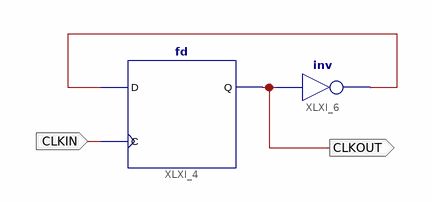
[diagram p0: schematic sheet 1]
// Xilinx ISE schematic ClockDiv2.sch (xbr) as structural Verilog: 2 symbols, 2 ports
module ClockDiv2 (
  input  CLKIN,
  output CLKOUT
);

  wire XLXN_1;

  fd XLXI_4 (.C(CLKIN), .D(XLXN_1), .Q(CLKOUT));
  not XLXI_6 (XLXN_1, CLKOUT);
endmodule
